# Altium schematic sheet sESP.SchDoc
size A3; Revision: 7
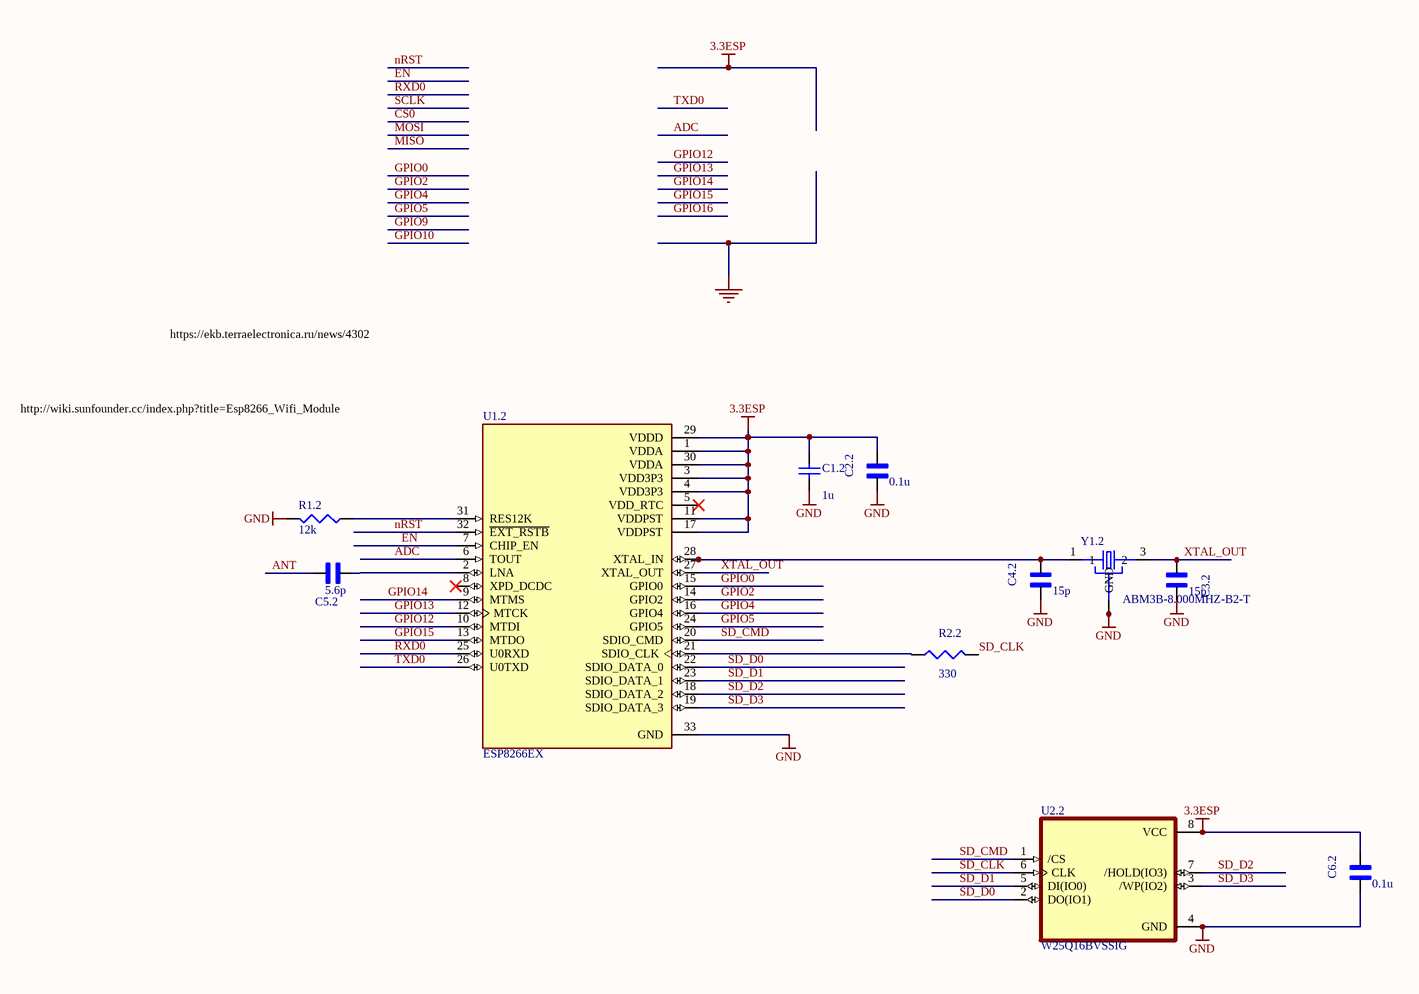
[diagram p0: sESP.SchDoc]

## Parts
C1.2  value 1u  [1608[0603]]  (hidden comment: Cap Semi)
C2.2  value 0.1u  [*CAPC1608X90]  (hidden comment: GX035C104MAT2-500)
C3.2  value 15p  [*CAPC1608X90N]  (hidden comment: GRM1885C2A150JA01J)
C4.2  value 15p  [*CAPC1608X90N]  (hidden comment: GRM1885C2A150JA01J)
C5.2  value 5.6p  [*CAPC1608X90]  (hidden comment: GX035C104MAT2-500)
C6.2  value 0.1u  [*CAPC1608X90]  (hidden comment: GX035C104MAT2-500)
R1.2  value 12k  [J1-0603]  (hidden comment: RC0603FR-0710KL)
R2.2  value 330  [J1-0603]  (hidden comment: Res3)
U1.2  ESP8266EX  [QFN50P500X500X80-33N]
U2.2  W25Q16BVSSIG  [SOIC127P790X216-8N]
Y1.2  ABM3B-8.000MHZ-B2-T  [OSCSC500X320X110-4N]

## Nets
3.3ESP: C1.2.1 C2.2.1 C6.2.1 U1.2.1(VDDA) U1.2.3(VDD3P3) U1.2.4(VDD3P3) U1.2.11(VDDPST) U1.2.17(VDDPST) U1.2.29(VDDD) U1.2.30(VDDA) U2.2.8(VCC)
GND: C1.2.2 C2.2.2 C3.2.2 C4.2.1 C6.2.2 R1.2.2 U1.2.33(GND) U2.2.4(GND) Y1.2.2(GND) Y1.2.4(GND)
ADC: U1.2.6(TOUT)
ANT: C5.2.1
EN: U1.2.7(CHIP_EN)
GPIO0: U1.2.15(GPIO0)
GPIO2: U1.2.14(GPIO2)
GPIO4: U1.2.16(GPIO4)
GPIO5: U1.2.24(GPIO5)
GPIO12: U1.2.10(MTDI)
GPIO13: U1.2.12(MTCK)
GPIO14: U1.2.9(MTMS)
GPIO15: U1.2.13(MTDO)
nRST: U1.2.32(~{EXT_RSTB})
RXD0: U1.2.25(U0RXD)
SD_CLK: R2.2.2 U2.2.6(CLK)
SD_CMD: U1.2.20(SDIO_CMD) U2.2.1(/CS)
SD_D0: U1.2.22(SDIO_DATA_0) U2.2.2(DO(IO1))
SD_D1: U1.2.23(SDIO_DATA_1) U2.2.5(DI(IO0))
SD_D2: U1.2.18(SDIO_DATA_2) U2.2.7(/HOLD(IO3))
SD_D3: U1.2.19(SDIO_DATA_3) U2.2.3(/WP(IO2))
TXD0: U1.2.26(U0TXD)
XTAL_OUT: C3.2.1 U1.2.27(XTAL_OUT) Y1.2.3(2)
NetC4.2_2: C4.2.2 U1.2.28(XTAL_IN) Y1.2.1
NetC5.2_2: C5.2.2 U1.2.2(LNA)
NetR1.2_1: R1.2.1 U1.2.31(RES12K)
NetR2.2_1: R2.2.1 U1.2.21(SDIO_CLK)

Not connected (* = marked no-connect by the designer): U1.2 5(VDD_RTC)* 8(XPD_DCDC)*

## Notes on the sheet
- https://ekb.terraelectronica.ru/news/4302
- http://wiki.sunfounder.cc/index.php?title=Esp8266_Wifi_Module

## Library data of the parts
C1.2 = Cap Semi: Capacitor (Semiconductor SIM Model); Published: 8-Jun-2000; LatestRevisionDate: 29-May-2009; LatestRevisionNote: IPC-7351 Footprint Added.; PackageReference: C1206; Publisher: Altium Limited; PackageDescription: Chip Capacitor
C2.2 C5.2 C6.2 = GX035C104MAT2-500: Cap Thin Film 0.1uf 50v 0603; MF: AVX; MP: GX035C104MAT2-500 or CL10B104JB8NNNC; Pacage Metric: 1608; Type: SMD; Package: 0603 AVX; SnapEDA_Link: https://www.snapeda.com/parts/GX035C104MAT2-500/AVX/view-part/?ref=snap
R1.2 = RC0603FR-0710KL: 10 kOhms 1 0.1 W 1 10 W Chip Resistor 0603 1608 Metric Thick Film; Pacage Metric: 1608; MF: Yageo or NXP; MP: 10K 1% 0603; ChipDip_Link: https://www.chipdip.ru/product0/9000079736; HelpURL: https://www.chipdip.ru/product0/9000079736; Package: R0603; Type: SMD; SnapEDA_Link: https://www.snapeda.com/parts/RC0603FR-0710KL/Yageo/view-part/?ref=dk&t=RC0603FR-0710KL&con_ref=None
R2.2 = Res3: Resistor; Pacage Metric: 1608; MP: RC0603FR-07330RL; ChipDip_Link: https://www.chipdip.ru/product0/9000079628; HelpURL: https://www.chipdip.ru/product0/9000079628; Package: R0603; Type: SMD
U1.2 = ESP8266EX: IC RF TxRx + MCU WiFi 802.11b/g/n 2.4GHz 32-VFQFN Exposed Pad; MF: Espressif Systems; SnapEDA_Link: https://www.snapeda.com/parts/ESP8266EX/Espressif%20Systems/view-part/555861/?ref=snap; Value: *; Purchase-URL: https://pricing.snapeda.com/search/part/ESP8266EX/?ref=eda; Price: None; Availability: Warning; MP: ESP8266EX; Package: VFQFN-32 Espressif Systems; Check_prices: https://www.snapeda.com/parts/ESP8266EX/Espressif%20Systems/view-part/555861/?ref=eda
U2.2 = W25Q16BVSSIG: Flash, pin, soic, flash, Memory, Semiconductors and Actives, serial, ic; MF: {'manufacturer': u'Winbond'}; MP: W25Q16BVSSIG; Availability: Unavailable; Value: *; Price: None; Package: None
Y1.2 = ABM3B-8.000MHZ-B2-T: Crystal 8MHz В±20ppm (Tol) В±50ppm (Stability) 18pF FUND 200Ohm 4-Pin CSMD T/R; MF: {'manufacturer': u'Abracon'}; Value: *; Price: None; Package: None; Availability: Unavailable; MP: ABM3B-8.000MHZ-B2-T
C3.2 C4.2 = GRM1885C2A150JA01J: SnapEDA_Link: https://www.snapeda.com/parts/GRM1885C2A150JA01J/Murata/view-part/1812122/?ref=snap; ChipDip_Link: https://www.chipdip.ru/product/grm1885c2a150j; HelpURL: https://static.chipdip.ru/lib/428/DOC005428493.pdf